# Altium schematic sheet B24.SchDoc
size A3
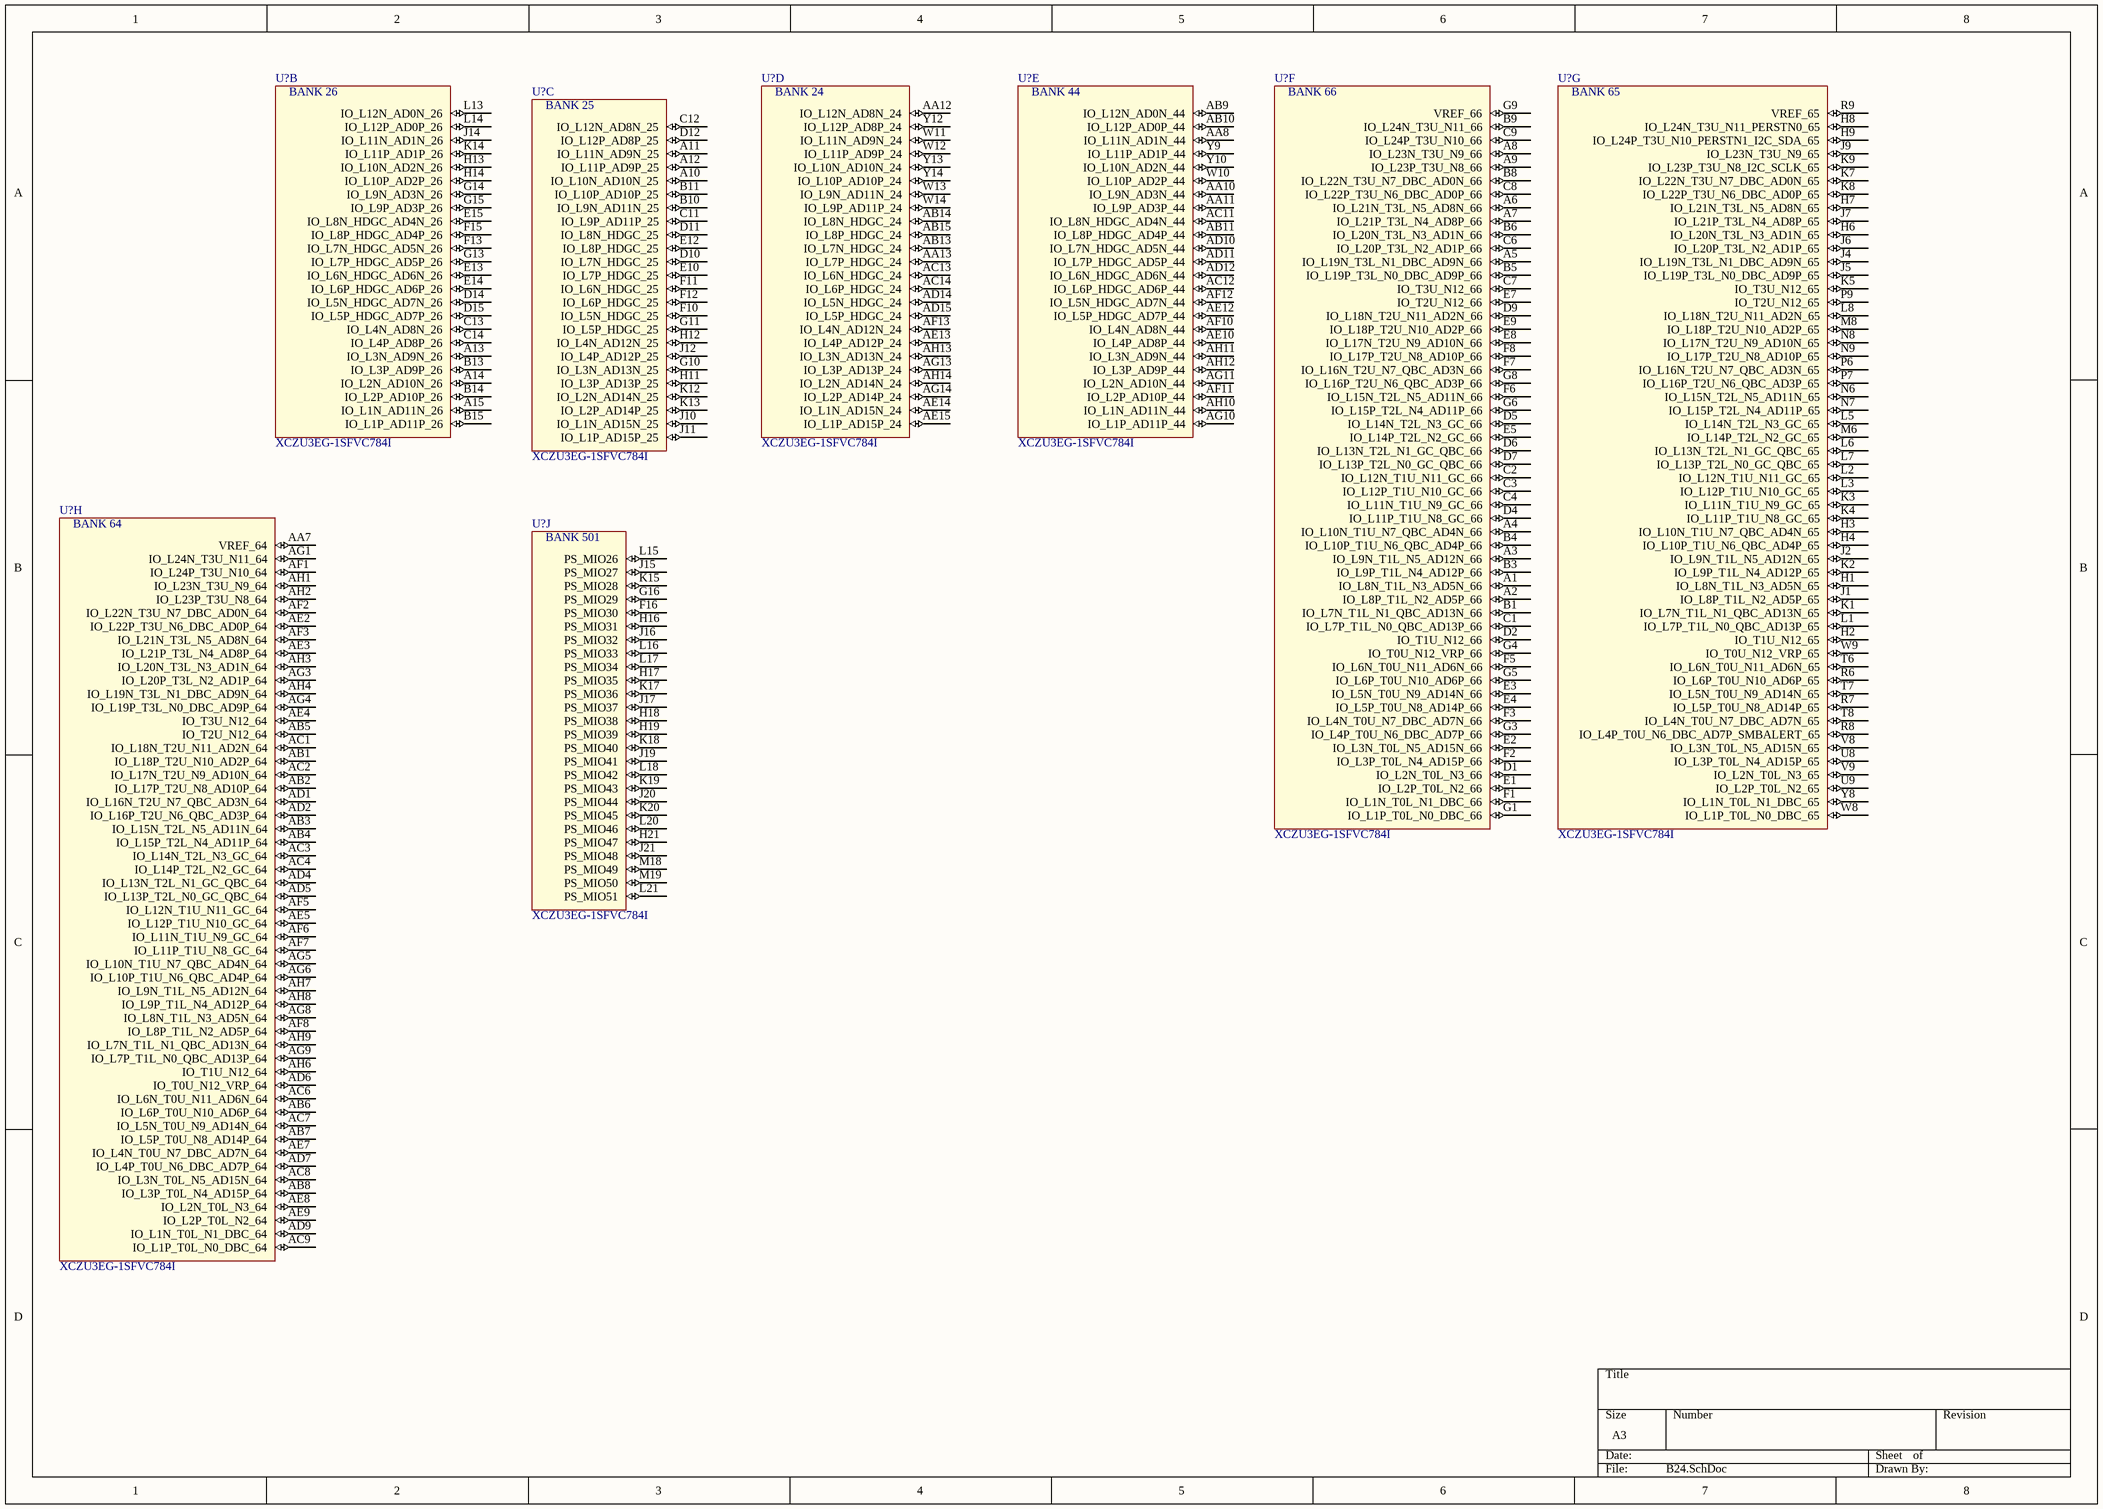
[diagram p0: B24.SchDoc]

## Parts
(Parts that share a designator on the sheet are numbered #1, #2 ... from top to bottom, then left to right.)
U?#1  XCZU3EG-1SFVC784I  [BGA784x28]  (part B of 22)
U?#2  XCZU3EG-1SFVC784I  [BGA784x28]  (part D of 22)
U?#3  XCZU3EG-1SFVC784I  [BGA784x28]  (part E of 22)
U?#4  XCZU3EG-1SFVC784I  [BGA784x28]  (part F of 22)
U?#5  XCZU3EG-1SFVC784I  [BGA784x28]  (part G of 22)
U?#6  XCZU3EG-1SFVC784I  [BGA784x28]  (part C of 22)
U?#7  XCZU3EG-1SFVC784I  [BGA784x28]  (part H of 22)
U?#8  XCZU3EG-1SFVC784I  [BGA784x28]  (part J of 22)

## Nets

Not connected (* = marked no-connect by the designer): U?#1 A13(IO_L3N_AD9N_26) A14(IO_L2N_AD10N_26) A15(IO_L1N_AD11N_26) B13(IO_L3P_AD9P_26) B14(IO_L2P_AD10P_26) B15(IO_L1P_AD11P_26) C13(IO_L4N_AD8N_26) C14(IO_L4P_AD8P_26) D14(IO_L5N_HDGC_AD7N_26) D15(IO_L5P_HDGC_AD7P_26) E13(IO_L6N_HDGC_AD6N_26) E14(IO_L6P_HDGC_AD6P_26) E15(IO_L8N_HDGC_AD4N_26) F13(IO_L7N_HDGC_AD5N_26) F15(IO_L8P_HDGC_AD4P_26) G13(IO_L7P_HDGC_AD5P_26) G14(IO_L9N_AD3N_26) G15(IO_L9P_AD3P_26) H13(IO_L10N_AD2N_26) H14(IO_L10P_AD2P_26) J14(IO_L11N_AD1N_26) K14(IO_L11P_AD1P_26) L13(IO_L12N_AD0N_26) L14(IO_L12P_AD0P_26); U?#2 AA12(IO_L12N_AD8N_24) AA13(IO_L7P_HDGC_24) AB13(IO_L7N_HDGC_24) AB14(IO_L8N_HDGC_24) AB15(IO_L8P_HDGC_24) AC13(IO_L6N_HDGC_24) AC14(IO_L6P_HDGC_24) AD14(IO_L5N_HDGC_24) AD15(IO_L5P_HDGC_24) AE13(IO_L4P_AD12P_24) AE14(IO_L1N_AD15N_24) AE15(IO_L1P_AD15P_24) AF13(IO_L4N_AD12N_24) AG13(IO_L3P_AD13P_24) AG14(IO_L2P_AD14P_24) AH13(IO_L3N_AD13N_24) AH14(IO_L2N_AD14N_24) W11(IO_L11N_AD9N_24) W12(IO_L11P_AD9P_24) W13(IO_L9N_AD11N_24) W14(IO_L9P_AD11P_24) Y12(IO_L12P_AD8P_24) Y13(IO_L10N_AD10N_24) Y14(IO_L10P_AD10P_24); U?#3 AA8(IO_L11N_AD1N_44) AA10(IO_L9N_AD3N_44) AA11(IO_L9P_AD3P_44) AB9(IO_L12N_AD0N_44) AB10(IO_L12P_AD0P_44) AB11(IO_L8P_HDGC_AD4P_44) AC11(IO_L8N_HDGC_AD4N_44) AC12(IO_L6P_HDGC_AD6P_44) AD10(IO_L7N_HDGC_AD5N_44) AD11(IO_L7P_HDGC_AD5P_44) AD12(IO_L6N_HDGC_AD6N_44) AE10(IO_L4P_AD8P_44) AE12(IO_L5P_HDGC_AD7P_44) AF10(IO_L4N_AD8N_44) AF11(IO_L2P_AD10P_44) AF12(IO_L5N_HDGC_AD7N_44) AG10(IO_L1P_AD11P_44) AG11(IO_L2N_AD10N_44) AH10(IO_L1N_AD11N_44) AH11(IO_L3N_AD9N_44) AH12(IO_L3P_AD9P_44) W10(IO_L10P_AD2P_44) Y9(IO_L11P_AD1P_44) Y10(IO_L10N_AD2N_44); U?#4 A1(IO_L8N_T1L_N3_AD5N_66) A2(IO_L8P_T1L_N2_AD5P_66) A3(IO_L9N_T1L_N5_AD12N_66) A4(IO_L10N_T1U_N7_QBC_AD4N_66) A5(IO_L19N_T3L_N1_DBC_AD9N_66) A6(IO_L21N_T3L_N5_AD8N_66) A7(IO_L21P_T3L_N4_AD8P_66) A8(IO_L23N_T3U_N9_66) A9(IO_L23P_T3U_N8_66) B1(IO_L7N_T1L_N1_QBC_AD13N_66) B3(IO_L9P_T1L_N4_AD12P_66) B4(IO_L10P_T1U_N6_QBC_AD4P_66) B5(IO_L19P_T3L_N0_DBC_AD9P_66) B6(IO_L20N_T3L_N3_AD1N_66) B8(IO_L22N_T3U_N7_DBC_AD0N_66) B9(IO_L24N_T3U_N11_66) C1(IO_L7P_T1L_N0_QBC_AD13P_66) C2(IO_L12N_T1U_N11_GC_66) C3(IO_L12P_T1U_N10_GC_66) C4(IO_L11N_T1U_N9_GC_66) C6(IO_L20P_T3L_N2_AD1P_66) C7(IO_T3U_N12_66) C8(IO_L22P_T3U_N6_DBC_AD0P_66) C9(IO_L24P_T3U_N10_66) D1(IO_L2N_T0L_N3_66) D2(IO_T1U_N12_66) D4(IO_L11P_T1U_N8_GC_66) D5(IO_L14N_T2L_N3_GC_66) D6(IO_L13N_T2L_N1_GC_QBC_66) D7(IO_L13P_T2L_N0_GC_QBC_66) D9(IO_L18N_T2U_N11_AD2N_66) E1(IO_L2P_T0L_N2_66) E2(IO_L3N_T0L_N5_AD15N_66) E3(IO_L5N_T0U_N9_AD14N_66) E4(IO_L5P_T0U_N8_AD14P_66) E5(IO_L14P_T2L_N2_GC_66) E7(IO_T2U_N12_66) E8(IO_L17N_T2U_N9_AD10N_66) E9(IO_L18P_T2U_N10_AD2P_66) F1(IO_L1N_T0L_N1_DBC_66) F2(IO_L3P_T0L_N4_AD15P_66) F3(IO_L4N_T0U_N7_DBC_AD7N_66) F5(IO_L6N_T0U_N11_AD6N_66) F6(IO_L15N_T2L_N5_AD11N_66) F7(IO_L16N_T2U_N7_QBC_AD3N_66) F8(IO_L17P_T2U_N8_AD10P_66) G1(IO_L1P_T0L_N0_DBC_66) G3(IO_L4P_T0U_N6_DBC_AD7P_66) G4(IO_T0U_N12_VRP_66) G5(IO_L6P_T0U_N10_AD6P_66) G6(IO_L15P_T2L_N4_AD11P_66) G8(IO_L16P_T2U_N6_QBC_AD3P_66) G9(VREF_66); U?#5 H1(IO_L8N_T1L_N3_AD5N_65) H2(IO_T1U_N12_65) H3(IO_L10N_T1U_N7_QBC_AD4N_65) H4(IO_L10P_T1U_N6_QBC_AD4P_65) H6(IO_L20N_T3L_N3_AD1N_65) H7(IO_L21N_T3L_N5_AD8N_65) H8(IO_L24N_T3U_N11_PERSTN0_65) H9(IO_L24P_T3U_N10_PERSTN1_I2C_SDA_65) J1(IO_L8P_T1L_N2_AD5P_65) J2(IO_L9N_T1L_N5_AD12N_65) J4(IO_L19N_T3L_N1_DBC_AD9N_65) J5(IO_L19P_T3L_N0_DBC_AD9P_65) J6(IO_L20P_T3L_N2_AD1P_65) J7(IO_L21P_T3L_N4_AD8P_65) J9(IO_L23N_T3U_N9_65) K1(IO_L7N_T1L_N1_QBC_AD13N_65) K2(IO_L9P_T1L_N4_AD12P_65) K3(IO_L11N_T1U_N9_GC_65) K4(IO_L11P_T1U_N8_GC_65) K5(IO_T3U_N12_65) K7(IO_L22N_T3U_N7_DBC_AD0N_65) K8(IO_L22P_T3U_N6_DBC_AD0P_65) K9(IO_L23P_T3U_N8_I2C_SCLK_65) L1(IO_L7P_T1L_N0_QBC_AD13P_65) L2(IO_L12N_T1U_N11_GC_65) L3(IO_L12P_T1U_N10_GC_65) L5(IO_L14N_T2L_N3_GC_65) L6(IO_L13N_T2L_N1_GC_QBC_65) L7(IO_L13P_T2L_N0_GC_QBC_65) L8(IO_L18N_T2U_N11_AD2N_65) M6(IO_L14P_T2L_N2_GC_65) M8(IO_L18P_T2U_N10_AD2P_65) N6(IO_L15N_T2L_N5_AD11N_65) N7(IO_L15P_T2L_N4_AD11P_65) N8(IO_L17N_T2U_N9_AD10N_65) N9(IO_L17P_T2U_N8_AD10P_65) P6(IO_L16N_T2U_N7_QBC_AD3N_65) P7(IO_L16P_T2U_N6_QBC_AD3P_65) P9(IO_T2U_N12_65) R6(IO_L6P_T0U_N10_AD6P_65) R7(IO_L5P_T0U_N8_AD14P_65) R8(IO_L4P_T0U_N6_DBC_AD7P_SMBALERT_65) R9(VREF_65) T6(IO_L6N_T0U_N11_AD6N_65) T7(IO_L5N_T0U_N9_AD14N_65) T8(IO_L4N_T0U_N7_DBC_AD7N_65) U8(IO_L3P_T0L_N4_AD15P_65) U9(IO_L2P_T0L_N2_65) V8(IO_L3N_T0L_N5_AD15N_65) V9(IO_L2N_T0L_N3_65) W8(IO_L1P_T0L_N0_DBC_65) W9(IO_T0U_N12_VRP_65) Y8(IO_L1N_T0L_N1_DBC_65); U?#6 A10(IO_L10N_AD10N_25) A11(IO_L11N_AD9N_25) A12(IO_L11P_AD9P_25) B10(IO_L9N_AD11N_25) B11(IO_L10P_AD10P_25) C11(IO_L9P_AD11P_25) C12(IO_L12N_AD8N_25) D10(IO_L7N_HDGC_25) D11(IO_L8N_HDGC_25) D12(IO_L12P_AD8P_25) E10(IO_L7P_HDGC_25) E12(IO_L8P_HDGC_25) F10(IO_L5N_HDGC_25) F11(IO_L6N_HDGC_25) F12(IO_L6P_HDGC_25) G10(IO_L3N_AD13N_25) G11(IO_L5P_HDGC_25) H11(IO_L3P_AD13P_25) H12(IO_L4N_AD12N_25) J10(IO_L1N_AD15N_25) J11(IO_L1P_AD15P_25) J12(IO_L4P_AD12P_25) K12(IO_L2N_AD14N_25) K13(IO_L2P_AD14P_25); U?#7 AA7(VREF_64) AB1(IO_L18P_T2U_N10_AD2P_64) AB2(IO_L17P_T2U_N8_AD10P_64) AB3(IO_L15N_T2L_N5_AD11N_64) AB4(IO_L15P_T2L_N4_AD11P_64) AB5(IO_T2U_N12_64) AB6(IO_L6P_T0U_N10_AD6P_64) AB7(IO_L5P_T0U_N8_AD14P_64) AB8(IO_L3P_T0L_N4_AD15P_64) AC1(IO_L18N_T2U_N11_AD2N_64) AC2(IO_L17N_T2U_N9_AD10N_64) AC3(IO_L14N_T2L_N3_GC_64) AC4(IO_L14P_T2L_N2_GC_64) AC6(IO_L6N_T0U_N11_AD6N_64) AC7(IO_L5N_T0U_N9_AD14N_64) AC8(IO_L3N_T0L_N5_AD15N_64) AC9(IO_L1P_T0L_N0_DBC_64) AD1(IO_L16N_T2U_N7_QBC_AD3N_64) AD2(IO_L16P_T2U_N6_QBC_AD3P_64) AD4(IO_L13N_T2L_N1_GC_QBC_64) AD5(IO_L13P_T2L_N0_GC_QBC_64) AD6(IO_T0U_N12_VRP_64) AD7(IO_L4P_T0U_N6_DBC_AD7P_64) AD9(IO_L1N_T0L_N1_DBC_64) AE2(IO_L22P_T3U_N6_DBC_AD0P_64) AE3(IO_L21P_T3L_N4_AD8P_64) AE4(IO_T3U_N12_64) AE5(IO_L12P_T1U_N10_GC_64) AE7(IO_L4N_T0U_N7_DBC_AD7N_64) AE8(IO_L2N_T0L_N3_64) AE9(IO_L2P_T0L_N2_64) AF1(IO_L24P_T3U_N10_64) AF2(IO_L22N_T3U_N7_DBC_AD0N_64) AF3(IO_L21N_T3L_N5_AD8N_64) AF5(IO_L12N_T1U_N11_GC_64) AF6(IO_L11N_T1U_N9_GC_64) AF7(IO_L11P_T1U_N8_GC_64) AF8(IO_L8P_T1L_N2_AD5P_64) AG1(IO_L24N_T3U_N11_64) AG3(IO_L20P_T3L_N2_AD1P_64) AG4(IO_L19P_T3L_N0_DBC_AD9P_64) AG5(IO_L10N_T1U_N7_QBC_AD4N_64) AG6(IO_L10P_T1U_N6_QBC_AD4P_64) AG8(IO_L8N_T1L_N3_AD5N_64) AG9(IO_L7P_T1L_N0_QBC_AD13P_64) AH1(IO_L23N_T3U_N9_64) AH2(IO_L23P_T3U_N8_64) AH3(IO_L20N_T3L_N3_AD1N_64) AH4(IO_L19N_T3L_N1_DBC_AD9N_64) AH6(IO_T1U_N12_64) AH7(IO_L9N_T1L_N5_AD12N_64) AH8(IO_L9P_T1L_N4_AD12P_64) AH9(IO_L7N_T1L_N1_QBC_AD13N_64); U?#8 F16(PS_MIO30) G16(PS_MIO29) H16(PS_MIO31) H17(PS_MIO35) H18(PS_MIO38) H19(PS_MIO39) H21(PS_MIO47) J15(PS_MIO27) J16(PS_MIO32) J17(PS_MIO37) J19(PS_MIO41) J20(PS_MIO44) J21(PS_MIO48) K15(PS_MIO28) K17(PS_MIO36) K18(PS_MIO40) K19(PS_MIO43) K20(PS_MIO45) L15(PS_MIO26) L16(PS_MIO33) L17(PS_MIO34) L18(PS_MIO42) L20(PS_MIO46) L21(PS_MIO51) M18(PS_MIO49) M19(PS_MIO50)

## Notes on the sheet
- (in symbol XCZU3EG-1SFVC784I, part B) BANK 26
- (in symbol XCZU3EG-1SFVC784I, part C) BANK 25
- (in symbol XCZU3EG-1SFVC784I, part D) BANK 24
- (in symbol XCZU3EG-1SFVC784I, part E) BANK 44
- (in symbol XCZU3EG-1SFVC784I, part F) BANK 66
- (in symbol XCZU3EG-1SFVC784I, part G) BANK 65
- (in symbol XCZU3EG-1SFVC784I, part H) BANK 64
- (in symbol XCZU3EG-1SFVC784I, part J) BANK 501

## Library data of the parts
U?#1-U?#8 = XCZU3EG-1SFVC784I: IC FPGA 252 I/O 784FCBGA - XILINX ZYNQ ULTRASCALE+; Manufacturer 1: Xilinx Inc.; Package: SFVC784; ComponentLink1Description: Datasheet; Supplier 1: Digi-Key; Supplier Part Number 1: XCZU3EG-1SFVC784I-ND; Manufacturer Part Number 1: XCZU3EG-1SFVC784I